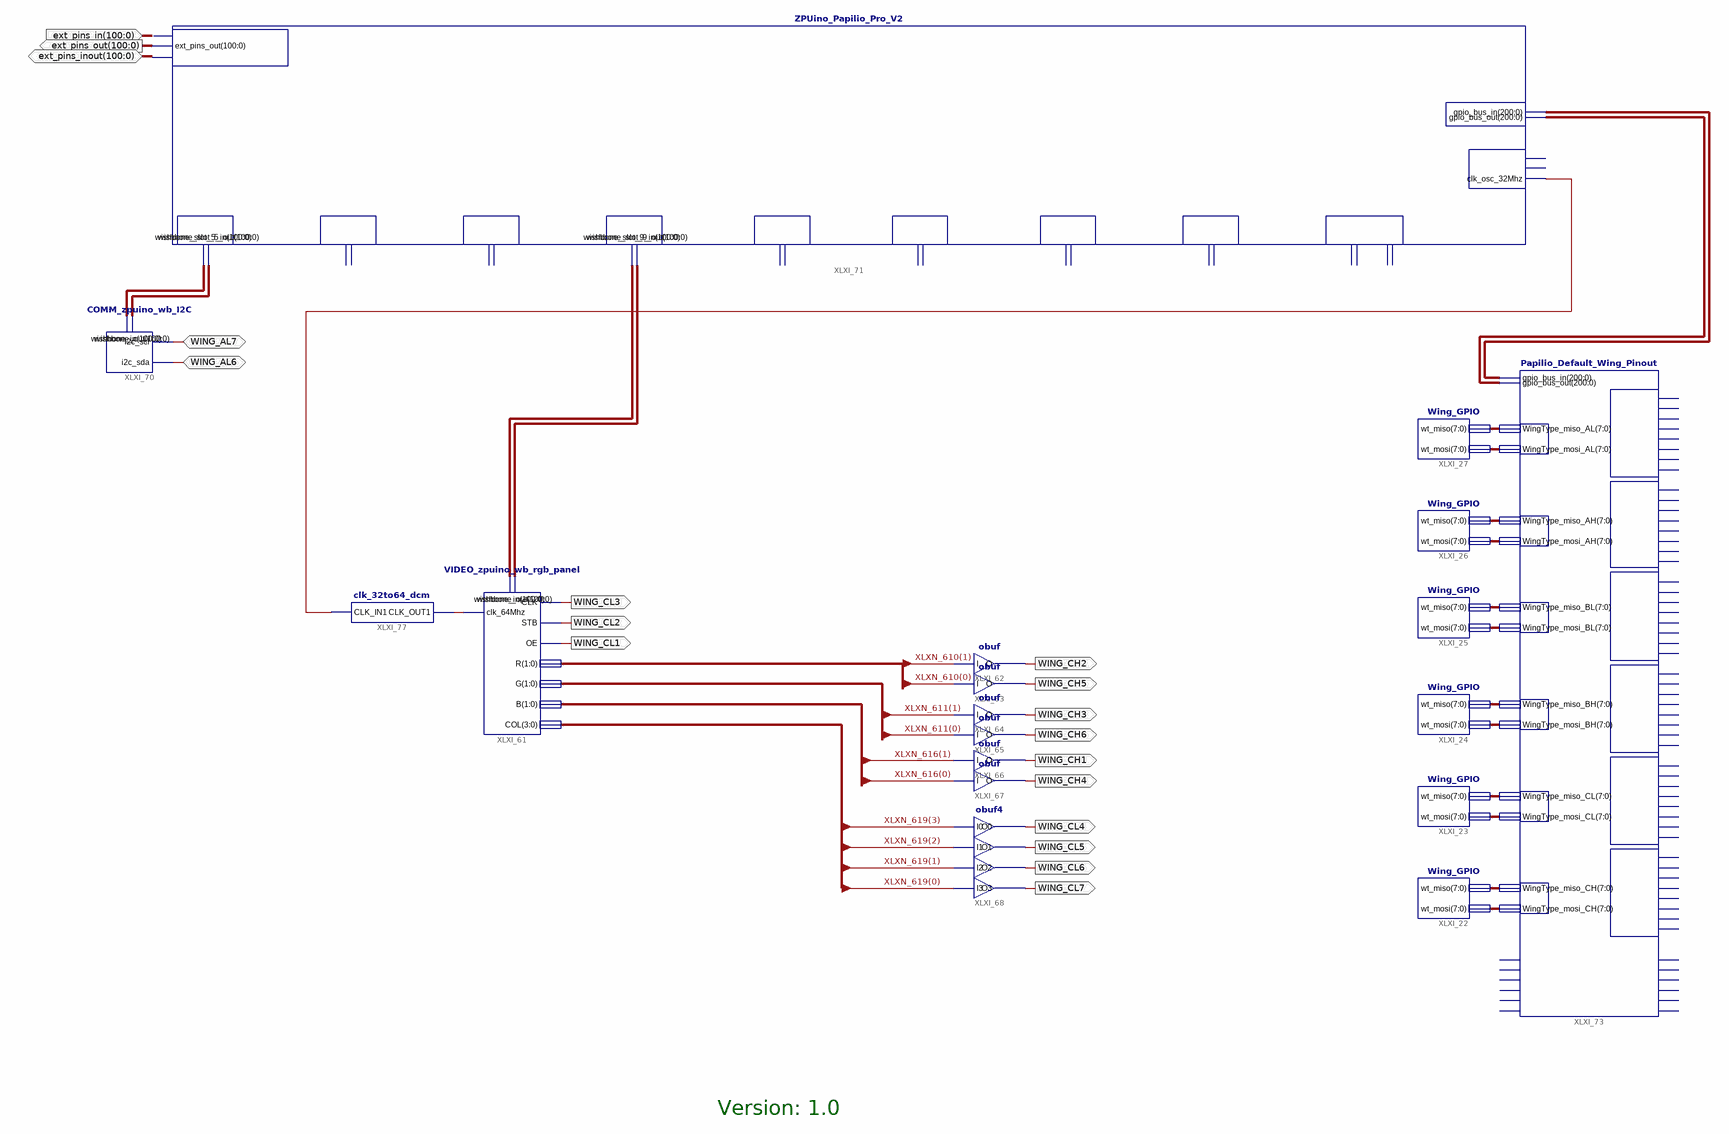
[diagram p0: schematic sheet 1]
// Xilinx ISE schematic Papilio_Pro.sch (spartan6) as structural Verilog: 18 symbols, 18 ports
module Papilio_Pro (
  input  [100:0] ext_pins_in,
  inout  [100:0] ext_pins_inout,
  inout  WING_AL6,
  inout  WING_AL7,
  output [100:0] ext_pins_out,
  output WING_CL3,
  output WING_CL2,
  output WING_CL1,
  output WING_CH2,
  output WING_CH4,
  output WING_CH3,
  output WING_CH6,
  output WING_CH1,
  output WING_CL4,
  output WING_CL5,
  output WING_CL6,
  output WING_CL7,
  output WING_CH5
);

  wire XLXN_633, XLXN_634;
  wire [1:0] XLXN_610, XLXN_611, XLXN_616;
  wire [3:0] XLXN_619;
  wire [7:0] XLXN_325, XLXN_326, XLXN_327, XLXN_328, XLXN_329, XLXN_330, XLXN_331, XLXN_332, XLXN_333,
       XLXN_334, XLXN_335, XLXN_336;
  wire [100:0] XLXN_622, XLXN_623, XLXN_626, XLXN_627;
  wire [200:0] XLXN_598, XLXN_599;

  Wing_GPIO XLXI_27 (.wt_miso(XLXN_335), .wt_mosi(XLXN_336));
  Wing_GPIO XLXI_26 (.wt_miso(XLXN_333), .wt_mosi(XLXN_334));
  Wing_GPIO XLXI_25 (.wt_miso(XLXN_331), .wt_mosi(XLXN_332));
  Wing_GPIO XLXI_24 (.wt_miso(XLXN_329), .wt_mosi(XLXN_330));
  Wing_GPIO XLXI_23 (.wt_miso(XLXN_327), .wt_mosi(XLXN_328));
  Wing_GPIO XLXI_22 (.wt_miso(XLXN_325), .wt_mosi(XLXN_326));
  VIDEO_zpuino_wb_rgb_panel XLXI_61 (
    .R(XLXN_610), .G(XLXN_611), .B(XLXN_616), .COL(XLXN_619), .CLK(WING_CL3), .STB(WING_CL2), .OE(WING_CL1),
    .wishbone_out(XLXN_623), .wishbone_in(XLXN_622), .clk_64Mhz(XLXN_633));
  obuf XLXI_62 (.I(XLXN_610[1]), .O(WING_CH2));
  obuf XLXI_63 (.I(XLXN_610[0]), .O(WING_CH5));
  obuf XLXI_64 (.I(XLXN_611[1]), .O(WING_CH3));
  obuf XLXI_65 (.I(XLXN_611[0]), .O(WING_CH6));
  obuf XLXI_66 (.I(XLXN_616[1]), .O(WING_CH1));
  obuf XLXI_67 (.I(XLXN_616[0]), .O(WING_CH4));
  obuf4 XLXI_68 (
    .I0(XLXN_619[3]), .I1(XLXN_619[2]), .I2(XLXN_619[1]), .I3(XLXN_619[0]), .O0(WING_CL4), .O1(WING_CL5),
    .O2(WING_CL6), .O3(WING_CL7));
  COMM_zpuino_wb_I2C XLXI_70 (.i2c_scl(WING_AL7), .i2c_sda(WING_AL6), .wishbone_in(XLXN_626), .wishbone_out(XLXN_627));
  ZPUino_Papilio_Pro_V2 XLXI_71 (
    .gpio_bus_out(XLXN_599), .gpio_bus_in(XLXN_598), .clk_osc_32Mhz(XLXN_634), .ext_pins_in(ext_pins_in),
    .ext_pins_out(ext_pins_out), .ext_pins_inout(ext_pins_inout), .wishbone_slot_5_out(XLXN_627),
    .wishbone_slot_5_in(XLXN_626), .wishbone_slot_9_in(XLXN_622), .wishbone_slot_9_out(XLXN_623));  // open: clk_96Mhz, clk_1Mhz, wishbone_slot_6_in, wishbone_slot_6_out, wishbone_slot_8_in, wishbone_slot_8_out, wishbone_slot_10_in, wishbone_slot_10_out, wishbone_slot_11_in, wishbone_slot_11_out, wishbone_slot_12_in, wishbone_slot_12_out, wishbone_slot_13_in, wishbone_slot_13_out, wishbone_slot_14_in, wishbone_slot_14_out, wishbone_slot_video_in, wishbone_slot_video_out
  Papilio_Default_Wing_Pinout XLXI_73 (
    .gpio_bus_out(XLXN_599), .gpio_bus_in(XLXN_598), .WingType_miso_BH(XLXN_329),
    .WingType_miso_BL(XLXN_331), .WingType_miso_AH(XLXN_333), .WingType_mosi_BL(XLXN_332),
    .WingType_mosi_BH(XLXN_330), .WingType_mosi_CL(XLXN_328), .WingType_mosi_AH(XLXN_334),
    .WingType_miso_CL(XLXN_327), .WingType_miso_CH(XLXN_325), .WingType_mosi_CH(XLXN_326),
    .WingType_mosi_AL(XLXN_336), .WingType_miso_AL(XLXN_335));  // open: WING_AH0, WING_AH1, WING_AH2, WING_AH3, WING_AH4, WING_AH5, WING_AH6, WING_AH7, WING_AL0, WING_AL1, WING_AL2, WING_AL3, WING_AL4, WING_AL5, WING_AL6, WING_AL7, WING_BH0, WING_BH1, WING_BH2, WING_BH3, WING_BH4, WING_BH5, WING_BH6, WING_BH7, WING_BL0, WING_BL1, WING_BL2, WING_BL3, WING_BL4, WING_BL5, WING_BL6, WING_BL7, WING_CL0, WING_CL1, WING_CL2, WING_CL3, WING_CL4, WING_CL5, WING_CL6, WING_CL7, WING_CH0, WING_CH1, WING_CH2, WING_CH3, WING_CH4, WING_CH5, WING_CH6, WING_CH7, Flex_Pin_out_0, Flex_Pin_out_1, Flex_Pin_out_2, Flex_Pin_out_3, Flex_Pin_out_4, Flex_Pin_out_5, Flex_Pin_in_0, Flex_Pin_in_1, Flex_Pin_in_2, Flex_Pin_in_3, Flex_Pin_in_4, Flex_Pin_in_5
  clk_32to64_dcm XLXI_77 (.CLK_IN1(XLXN_634), .CLK_OUT1(XLXN_633));

  // Notes on the sheet:
  //   Version: 1.0
endmodule
